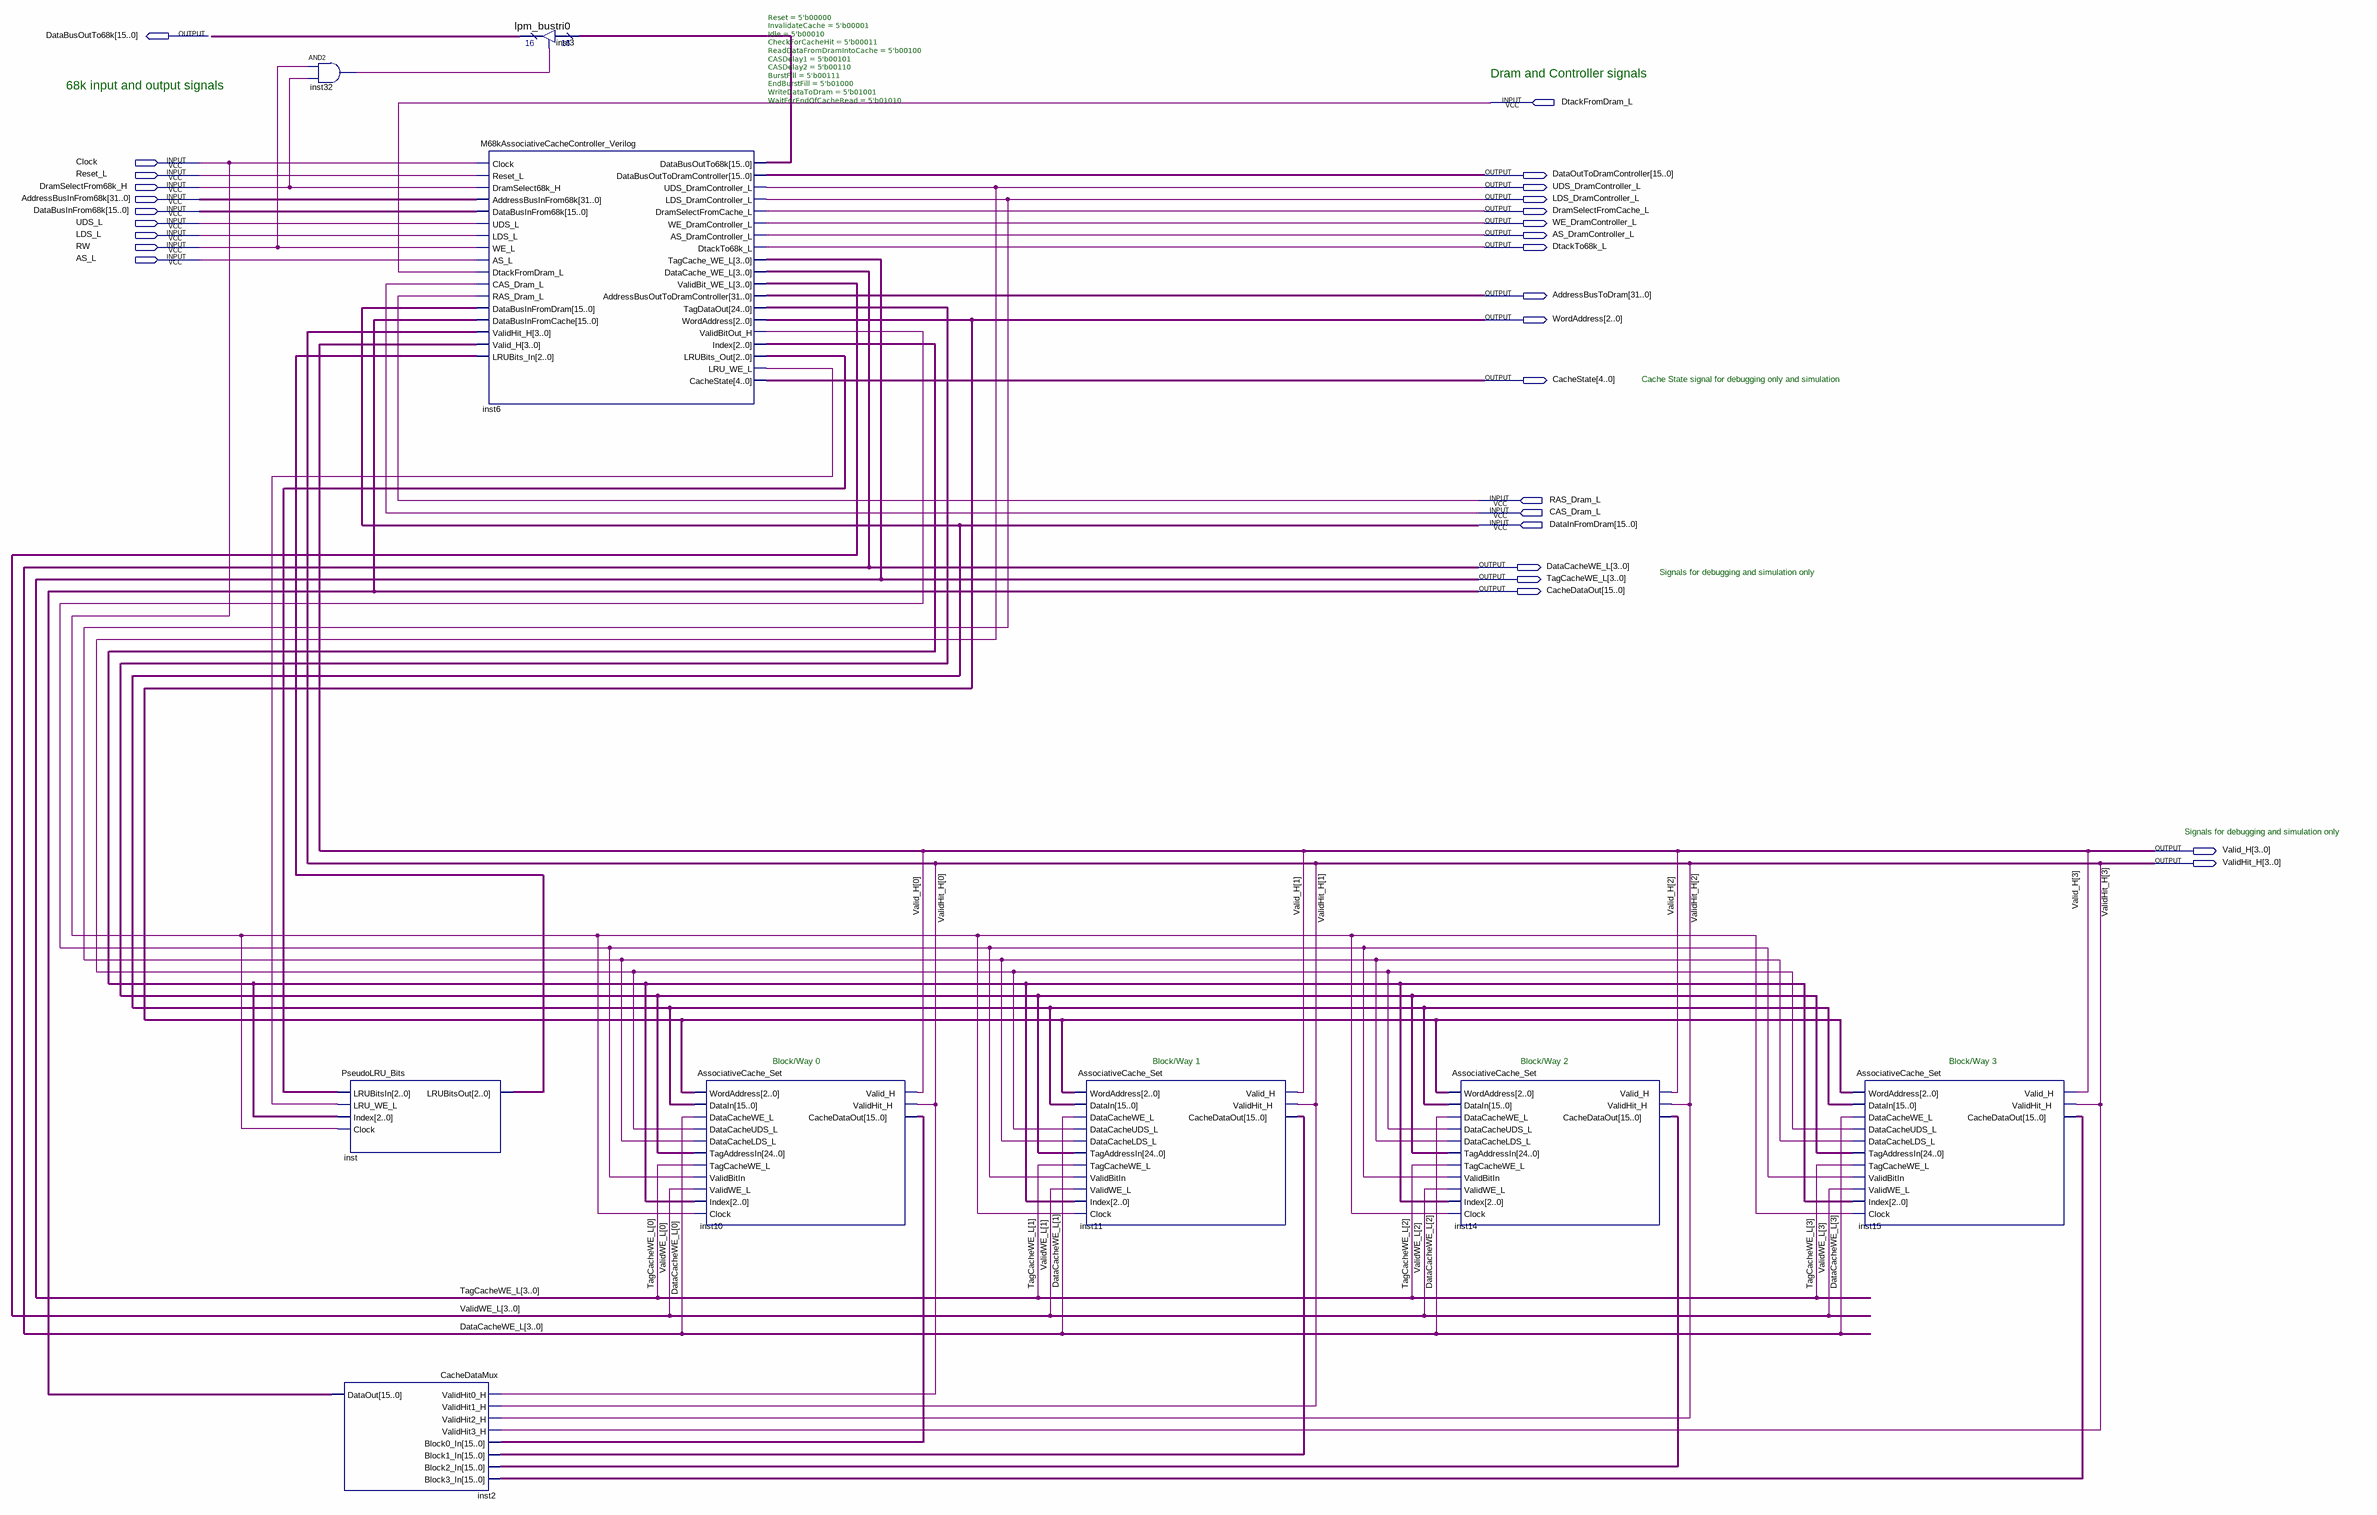
[diagram p0: schematic sheet]
// Quartus schematic AssociativeDramCache.bdf as structural Verilog: 9 symbols, 29 pins
module AssociativeDramCache (
  input  DtackFromDram_L,
  input  Clock,
  input  Reset_L,
  input  DramSelectFrom68k_H,
  input  [31:0] AddressBusInFrom68k,
  input  [15:0] DataBusInFrom68k,
  input  UDS_L,
  input  LDS_L,
  input  RW,
  input  AS_L,
  input  RAS_Dram_L,
  input  CAS_Dram_L,
  input  [15:0] DataInFromDram,
  output [15:0] DataBusOutTo68k,
  output [15:0] DataOutToDramController,
  output UDS_DramController_L,
  output LDS_DramController_L,
  output DramSelectFromCache_L,
  output WE_DramController_L,
  output AS_DramController_L,
  output DtackTo68k_L,
  output [31:0] AddressBusToDram,
  output [2:0] WordAddress,
  output [4:0] CacheState,
  output [3:0] DataCacheWE_L,
  output [3:0] TagCacheWE_L,
  output [15:0] CacheDataOut,
  output [3:0] Valid_H,
  output [3:0] ValidHit_H
);

  wire inst6_lru_we_l, inst6_validbitout_h, inst32_out;
  wire [2:0] inst6_index, inst6_lrubits_out, inst_lrubitsout;
  wire [3:0] ValidWE_L;
  wire [15:0] inst6_databusoutto68k, inst10_cachedataout, inst11_cachedataout, inst14_cachedataout,
       inst15_cachedataout;
  wire [24:0] inst6_tagdataout;

  and inst32 (inst32_out, RW, DramSelectFrom68k_H);
  PseudoLRU_Bits inst (
    .LRUBitsIn(inst6_lrubits_out), .LRU_WE_L(inst6_lru_we_l), .Index(inst6_index), .Clock(Clock),
    .LRUBitsOut(inst_lrubitsout));
  CacheDataMux inst2 (
    .ValidHit0_H(ValidHit_H[0]), .ValidHit1_H(ValidHit_H[1]), .ValidHit2_H(ValidHit_H[2]),
    .ValidHit3_H(ValidHit_H[3]), .Block0_In(inst10_cachedataout), .Block1_In(inst11_cachedataout),
    .Block2_In(inst14_cachedataout), .Block3_In(inst15_cachedataout), .DataOut(CacheDataOut));
  M68kAssociativeCacheController_Verilog #(.Reset(5'b00000), .InvalidateCache(5'b00001), .Idle(5'b00010), .CheckForCacheHit(5'b00011), .ReadDataFromDramIntoCache(5'b00100), .CASDelay1(5'b00101), .CASDelay2(5'b00110), .BurstFill(5'b00111), .EndBurstFill(5'b01000), .WriteDataToDram(5'b01001), .WaitForEndOfCacheRead(5'b01010)) inst6 (
    .Clock(Clock), .Reset_L(Reset_L), .DramSelect68k_H(DramSelectFrom68k_H),
    .AddressBusInFrom68k(AddressBusInFrom68k), .DataBusInFrom68k(DataBusInFrom68k), .UDS_L(UDS_L),
    .LDS_L(LDS_L), .WE_L(RW), .AS_L(AS_L), .DtackFromDram_L(DtackFromDram_L), .CAS_Dram_L(CAS_Dram_L),
    .RAS_Dram_L(RAS_Dram_L), .DataBusInFromDram(DataInFromDram), .DataBusInFromCache(CacheDataOut),
    .ValidHit_H(ValidHit_H), .Valid_H(Valid_H), .LRUBits_In(inst_lrubitsout),
    .DataBusOutTo68k(inst6_databusoutto68k), .DataBusOutToDramController(DataOutToDramController),
    .UDS_DramController_L(UDS_DramController_L), .LDS_DramController_L(LDS_DramController_L),
    .DramSelectFromCache_L(DramSelectFromCache_L), .WE_DramController_L(WE_DramController_L),
    .AS_DramController_L(AS_DramController_L), .DtackTo68k_L(DtackTo68k_L), .TagCache_WE_L(TagCacheWE_L),
    .DataCache_WE_L(DataCacheWE_L), .ValidBit_WE_L(ValidWE_L),
    .AddressBusOutToDramController(AddressBusToDram), .TagDataOut(inst6_tagdataout),
    .WordAddress(WordAddress), .ValidBitOut_H(inst6_validbitout_h), .Index(inst6_index),
    .LRUBits_Out(inst6_lrubits_out), .LRU_WE_L(inst6_lru_we_l), .CacheState(CacheState));
  lpm_bustri0 inst3 (.enabledt(inst32_out), .data(inst6_databusoutto68k), .tridata(DataBusOutTo68k));
  AssociativeCache_Set inst10 (
    .WordAddress(WordAddress), .DataIn(DataInFromDram), .DataCacheWE_L(DataCacheWE_L[0]),
    .DataCacheUDS_L(UDS_DramController_L), .DataCacheLDS_L(LDS_DramController_L),
    .TagAddressIn(inst6_tagdataout), .TagCacheWE_L(TagCacheWE_L[0]), .ValidBitIn(inst6_validbitout_h),
    .ValidWE_L(ValidWE_L[0]), .Index(inst6_index), .Clock(Clock), .Valid_H(Valid_H[0]),
    .ValidHit_H(ValidHit_H[0]), .CacheDataOut(inst10_cachedataout));
  AssociativeCache_Set inst11 (
    .WordAddress(WordAddress), .DataIn(DataInFromDram), .DataCacheWE_L(DataCacheWE_L[1]),
    .DataCacheUDS_L(UDS_DramController_L), .DataCacheLDS_L(LDS_DramController_L),
    .TagAddressIn(inst6_tagdataout), .TagCacheWE_L(TagCacheWE_L[1]), .ValidBitIn(inst6_validbitout_h),
    .ValidWE_L(ValidWE_L[1]), .Index(inst6_index), .Clock(Clock), .Valid_H(Valid_H[1]),
    .ValidHit_H(ValidHit_H[1]), .CacheDataOut(inst11_cachedataout));
  AssociativeCache_Set inst14 (
    .WordAddress(WordAddress), .DataIn(DataInFromDram), .DataCacheWE_L(DataCacheWE_L[2]),
    .DataCacheUDS_L(UDS_DramController_L), .DataCacheLDS_L(LDS_DramController_L),
    .TagAddressIn(inst6_tagdataout), .TagCacheWE_L(TagCacheWE_L[2]), .ValidBitIn(inst6_validbitout_h),
    .ValidWE_L(ValidWE_L[2]), .Index(inst6_index), .Clock(Clock), .Valid_H(Valid_H[2]),
    .ValidHit_H(ValidHit_H[2]), .CacheDataOut(inst14_cachedataout));
  AssociativeCache_Set inst15 (
    .WordAddress(WordAddress), .DataIn(DataInFromDram), .DataCacheWE_L(DataCacheWE_L[3]),
    .DataCacheUDS_L(UDS_DramController_L), .DataCacheLDS_L(LDS_DramController_L),
    .TagAddressIn(inst6_tagdataout), .TagCacheWE_L(TagCacheWE_L[3]), .ValidBitIn(inst6_validbitout_h),
    .ValidWE_L(ValidWE_L[3]), .Index(inst6_index), .Clock(Clock), .Valid_H(Valid_H[3]),
    .ValidHit_H(ValidHit_H[3]), .CacheDataOut(inst15_cachedataout));

  // Notes on the sheet:
  //   Dram and Controller signals
  //   68k input and output signals
  //   Cache State signal for debugging only and simulation
  //   Signals for debugging and simulation only 
  //   Signals for debugging and simulation only 
  //   Block/Way 0
  //   Block/Way 1
  //   Block/Way 2
  //   Block/Way 3
endmodule
